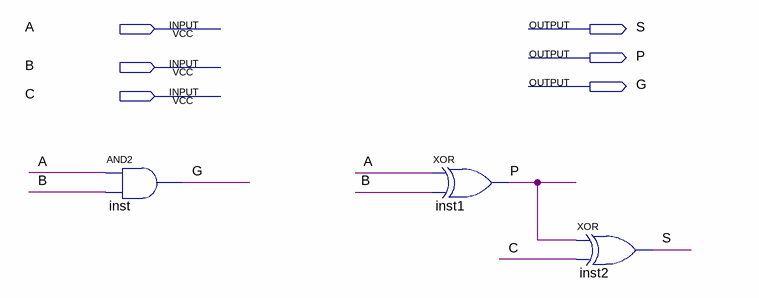
[diagram p0: schematic sheet]
// Quartus schematic FA_cla.bdf as structural Verilog: 3 symbols, 6 pins
module FA_cla (
  input  A,
  input  B,
  input  C,
  output S,
  output P,
  output G
);

  and inst (G, A, B);
  xor inst1 (P, A, B);
  xor inst2 (S, P, C);
endmodule
